# Altium project arduino.PrjPcb
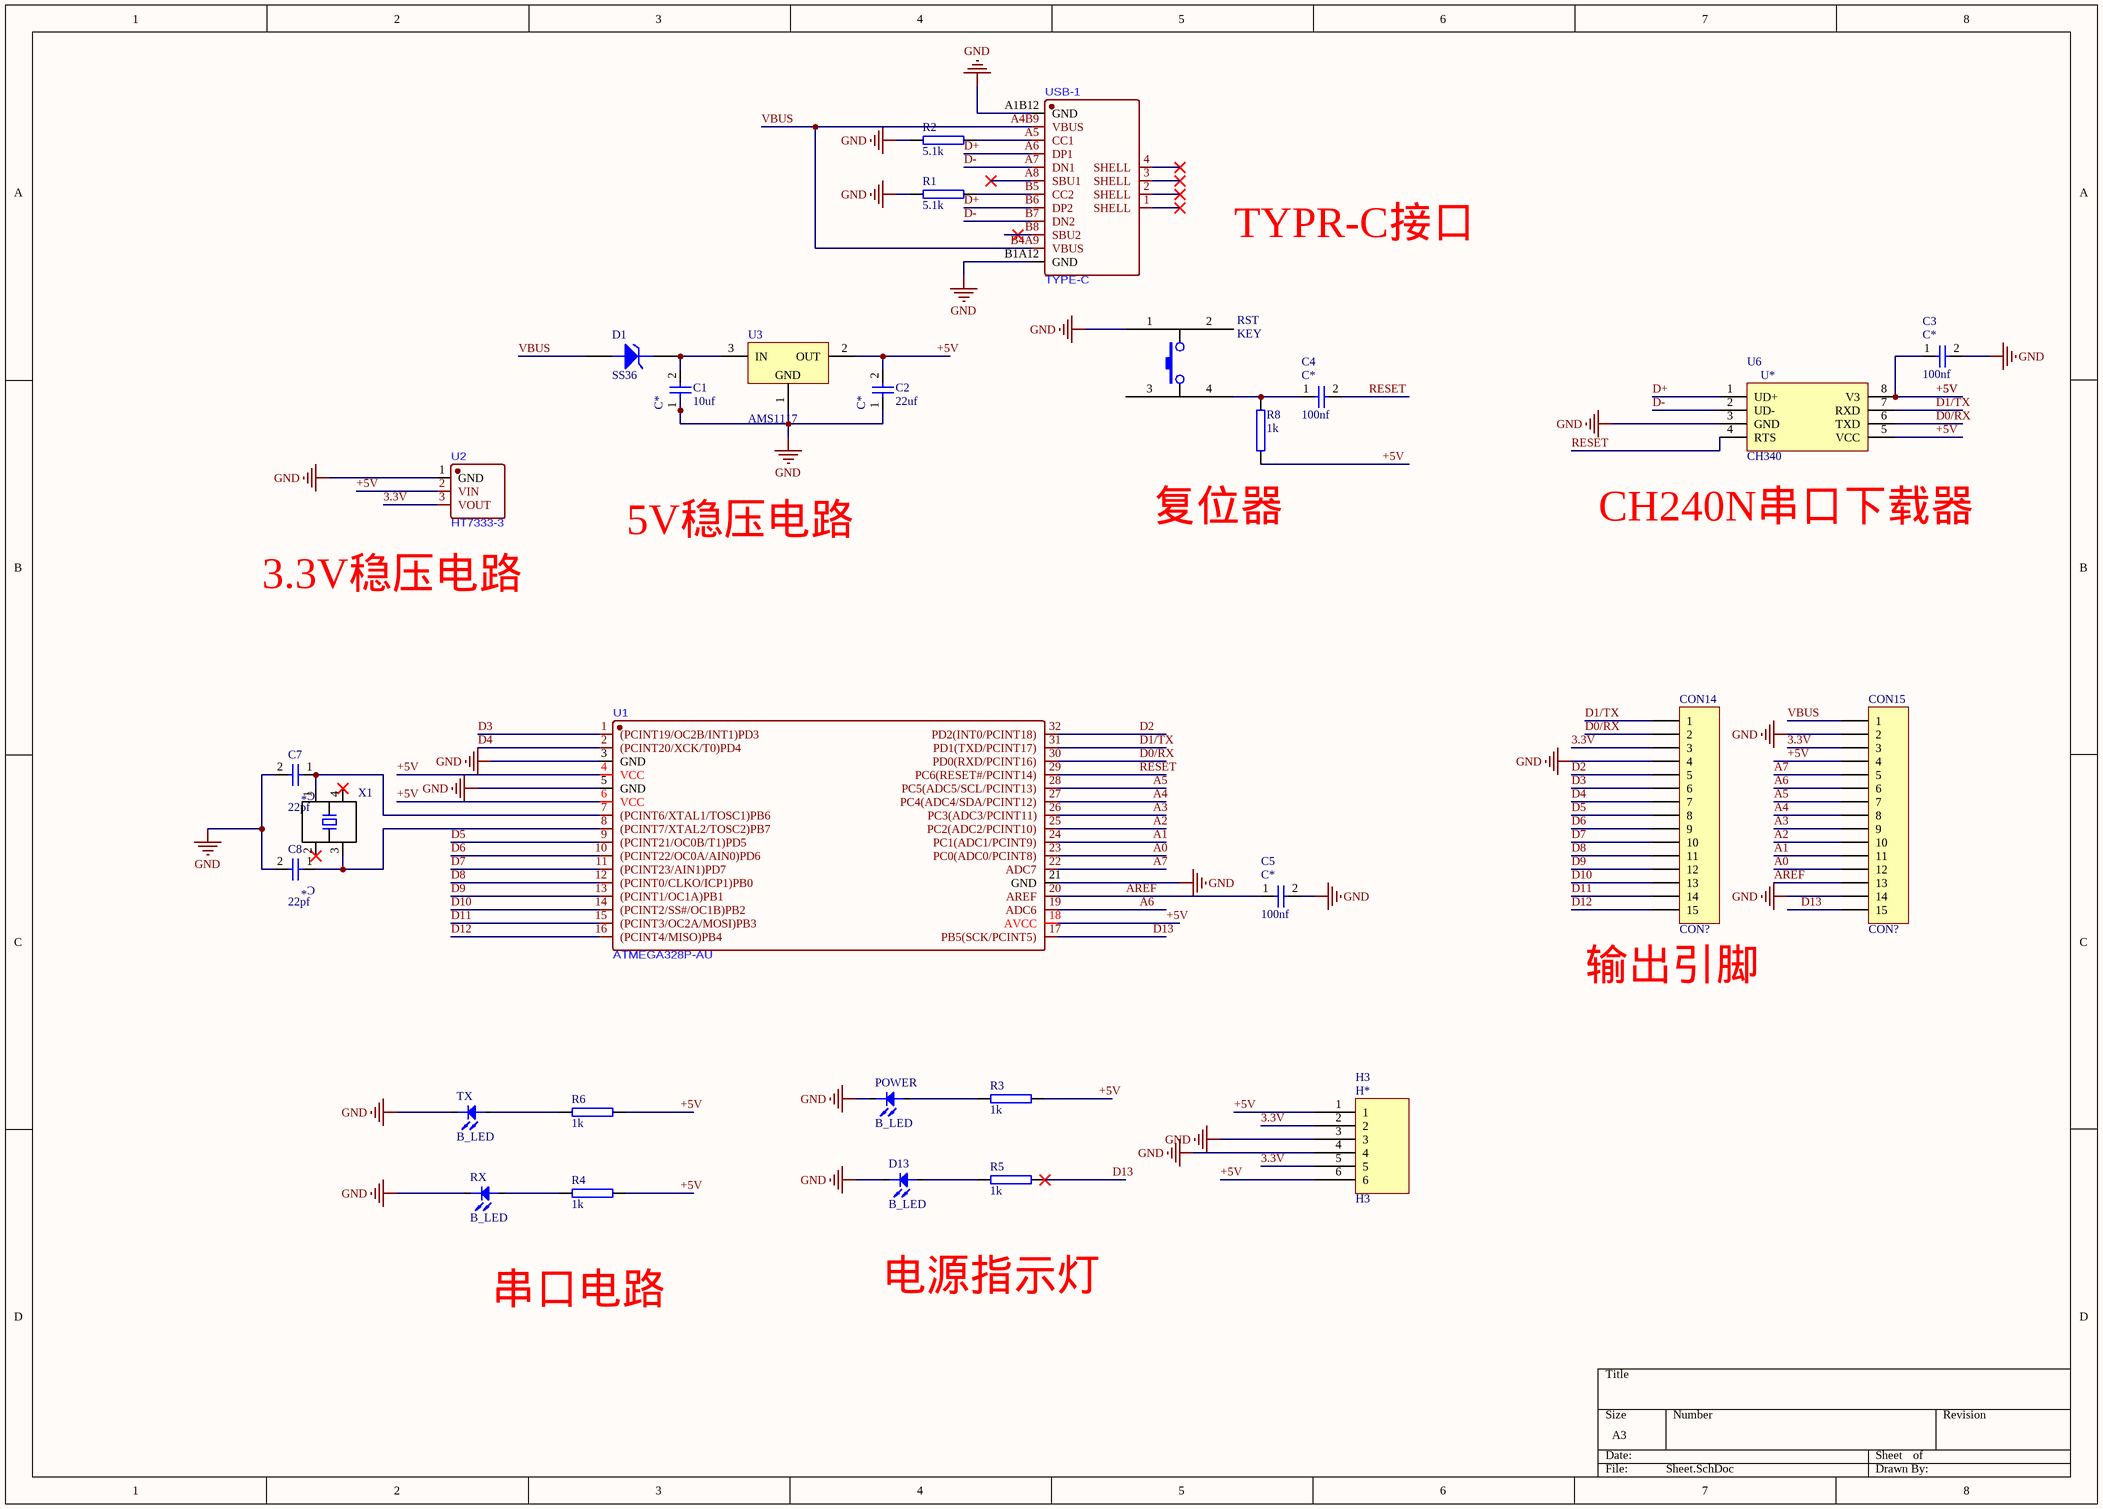
[diagram p0: Sheet.SchDoc]
1 sheet, 29 parts. Net scope: global (net labels, ports and power ports of the same name join across sheets).
Board file: Arduino NANO V3_PCB_2022-07-13.pcbdoc

## Sheet Sheet.SchDoc
size A3; SheetNumber: 1; SheetTotal: 1

### Parts
C1  10uf  [C0603]
C2  22uf  [C0603]
C3  100nf  [C0603]
C4  100nf  [C0603]
C5  100nf  [C0603]
C7  22pf  [C0603]
C8  22pf  [C0603]
CON14  CON?  [HDR-TH_15P-P2.54-V-F - duplicate]
CON15  CON?  [HDR-TH_15P-P2.54-V-F]
D1  SS36  [SMA_L4.3-W2.6-LS5.2-RD]
D13  B_LED  [LED0603-R-RD]
H3  H3  [HDR-TH_6P-P2.54-V_Z-211-0611-0021-001]
POWER  B_LED  [LED0603-R-RD]
R1  5.1k  [R0603]
R2  5.1k  [R0603]
R3  1k  [R0603]
R4  1k  [R0603]
R5  1k  [R0603]
R6  1k  [R0603]
R8  1k  [R0603]
RST  KEY  [KEY-SMD_4P-]
RX  B_LED  [LED0603-R-RD]
TX  B_LED  [LED0603-R-RD]
U1  ATMEGA328P-AU  [arduino--main_IC]
U2  HT7333-3  [SOT-89-3_L4.5-W2.5-P1.50-LS4.2-BR]
U3  AMS1117  [SOT223_N]
U6  CH340  [CH340]
USB-1  TYPE-C  [USB-C-TYPE-C]
X1  jinzhen  [JINZHEN]  (value not drawn)

### Nets
GND: C1.1 C2.1 C3.2 C5.2 C7.2 C8.2 CON14.4 CON15.2 CON15.14 D13.2 H3.3 H3.4 POWER.2 R1.1 R2.1 RST.1 RX.2 TX.2 U1.3(GND) U1.5(GND) U1.21(GND) U2.1(GND) U3.1(GND) U6.3(GND) USB-1.A1B12(GND) USB-1.B1A12(GND)
3.3V: CON14.3 CON15.3 H3.2 H3.5 U2.3(VOUT)
+5V: C2.2 C3.1 CON15.4 H3.1 H3.6 R3.2 R4.2 R6.2 R8.1 U1.4(VCC) U1.6(VCC) U1.18(AVCC) U2.2(VIN) U3.2(OUT) U6.5(VCC) U6.8(V3)
A0: CON15.12 U1.23(PC0(ADC0/PCINT8))
A1: CON15.11 U1.24(PC1(ADC1/PCINT9))
A2: CON15.10 U1.25(PC2(ADC2/PCINT10))
A3: CON15.9 U1.26(PC3(ADC3/PCINT11))
A4: CON15.8 U1.27(PC4(ADC4/SDA/PCINT12))
A5: CON15.7 U1.28(PC5(ADC5/SCL/PCINT13))
A6: CON15.6 U1.19(ADC6)
A7: CON15.5 U1.22(ADC7)
AREF: C5.1 CON15.13 U1.20(AREF)
D0/RX: CON14.2 U1.30(PD0(RXD/PCINT16)) U6.6(TXD)
D1/TX: CON14.1 U1.31(PD1(TXD/PCINT17)) U6.7(RXD)
D2: CON14.5 U1.32(PD2(INT0/PCINT18))
D3: CON14.6 U1.1((PCINT19/OC2B/INT1)PD3)
D4: CON14.7 U1.2((PCINT20/XCK/T0)PD4)
D5: CON14.8 U1.9((PCINT21/OC0B/T1)PD5)
D6: CON14.9 U1.10((PCINT22/OC0A/AIN0)PD6)
D7: CON14.10 U1.11((PCINT23/AIN1)PD7)
D8: CON14.11 U1.12((PCINT0/CLKO/ICP1)PB0)
D9: CON14.12 U1.13((PCINT1/OC1A)PB1)
D10: CON14.13 U1.14((PCINT2/SS#/OC1B)PB2)
D11: CON14.14 U1.15((PCINT3/OC2A/MOSI)PB3)
D12: CON14.15 U1.16((PCINT4/MISO)PB4)
D13: CON15.15 R5.2 U1.17(PB5(SCK/PCINT5))
D+: U6.1(UD+) USB-1.A6(DP1) USB-1.B6(DP2)
D-: U6.2(UD-) USB-1.A7(DN1) USB-1.B7(DN2)
RESET: C4.2 U1.29(PC6(RESET#/PCINT14)) U6.4(RTS)
VBUS: CON15.1 D1.1(A) USB-1.A4B9(VBUS) USB-1.B4A9(VBUS)
NetC1_2: C1.2 D1.2(K) U3.3(IN)
NetC4_1: C4.1 R8.2 RST.4
NetC7_1: C7.1 U1.7((PCINT6/XTAL1/TOSC1)PB6) X1.1
NetC8_1: C8.1 U1.8((PCINT7/XTAL2/TOSC2)PB7) X1.3
NetD13_1: D13.1 R5.1
NetPOWER_1: POWER.1 R3.1
NetR1_2: R1.2 USB-1.B5(CC2)
NetR2_2: R2.2 USB-1.A5(CC1)
NetR4_1: R4.1 RX.1
NetR6_1: R6.1 TX.1

Not connected (* = marked no-connect by the designer): RST 2 3; USB-1 1(SHELL)* 2(SHELL)* 3(SHELL)* 4(SHELL)* A8(SBU1)* B8(SBU2)*; X1 2 4*

### Notes on the sheet
- TYPR-C接口
- 5V稳压电路
- (near R8) 复位器
- (near U6) CH240N串口下载器
- (near U2) 3.3V稳压电路
- (near CON14) 输出引脚
- 串口电路
- 电源指示灯
- (in symbol CAP) C*
- (in symbol CAP_1) C*
- (in symbol CAP_2) C*
- (in symbol CAP_3) C*
- (in symbol CH340) U*
- (in symbol H?) H*

### Library data of the parts
C1 = CAP_2: 电容0603
C2 = CAP_3: 电容0603
C3-C5 = CAP_1: 电容0603
C7 C8 = CAP: 电容0603
CON14 CON15 = CON？: 插针
D1 = SS36: 稳压二极管
D13 POWER RX TX = B_LED: LED灯
H3 = H?: 插针
R1 R2 = RES_1: 电阻
R3-R6 R8 = RES: 电阻
RST = KEY: 开关
U1 = ATMEGA328P-AU: 主芯片
U2 = MD8310A: 线性稳压芯片
U3 = AMS1117: LDO线性稳压（5v）
USB-1 = TYPE-C: type-c供电插口
X1 = JT: 晶振